# EAGLE design sensor_de aplausos (EAGLE 6.5.0)
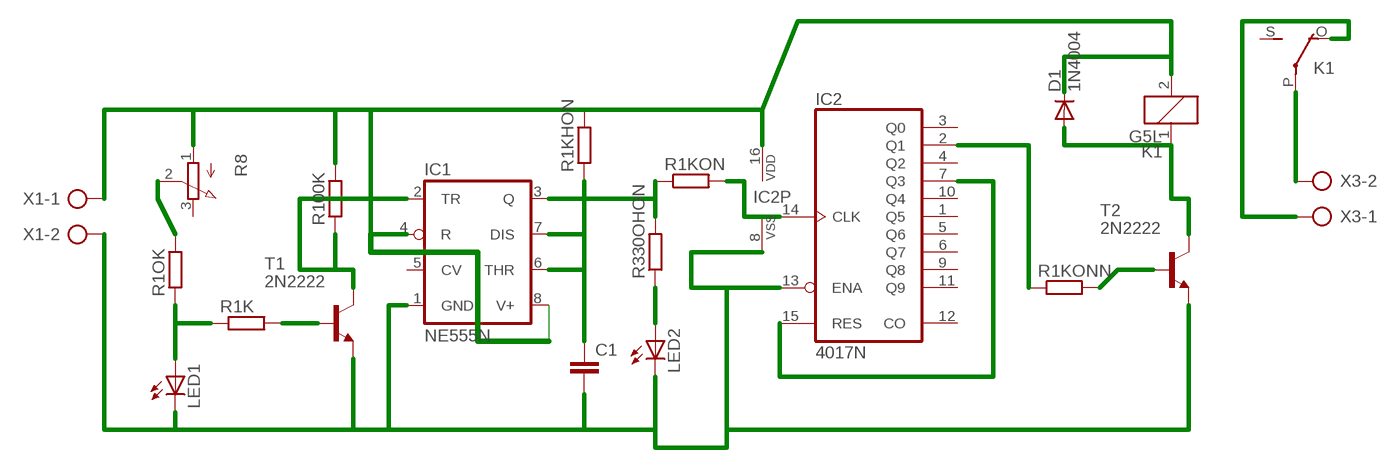
[diagram p0: schematic, sheet 1]

## Parts
C1  C5/5  [C5B5]
D1  1N4004  [DO41-10]
IC1  NE555N  [DIL08]
IC2  4017N  [DIL16]
K1  G5L  [G5LE]
LED1  LED5MM  [LED5MM]
LED2  LED5MM  [LED5MM]
R1K  R-EU_0207/12  [0207/12]
R1KHON  R-EU_0207/12  [0207/12]
R1KON  R-EU_0207/12  [0207/12]
R1KONN  R-EU_0207/12  [0207/12]
R1OK  R-EU_0207/12  [0207/12]
R8  3RP/1610N  [3RP/1610N]
R100K  R-EU_0207/12  [0207/12]
R330OHON  R-EU_0207/12  [0207/12]
T1  2N2222  [TO18]
T2  2N2222  [TO18]
X1  AK300/2  [AK300/2]
X3  AK300/2  [AK300/2]

## Nets
N$1: K1.P(2:P) X3.2
N$2: R1OK.2 R8.2(S)
N$4: D1.C IC1.4(R) IC1.8(V+) IC2.16(VDD) K1.2 R1KHON.2 R8.1(A) R100K.2 X1.1
N$5: LED1.A R1K.1 R1OK.1
N$6: IC1.2(TR) R100K.1 T1.3(C)
N$7: R1K.2 T1.2(B)
N$8: K1.O(2:O) X3.1
N$10: C1.1 IC1.6(THR) IC1.7(DIS) R1KHON.1
N$11: IC2.2(Q1) R1KONN.1
N$12: D1.A K1.1 T2.3(C)
N$13: IC1.3(Q) R1KON.1 R330OHON.2
N$14: LED2.A R330OHON.1
N$15: R1KONN.2 T2.2(B)
N$16: IC2.14(CLK) R1KON.2
N$17: IC2.7(Q3) IC2.15(RES)
N$18: C1.2 IC1.1(GND) IC2.8(VSS) IC2.13(ENA) LED1.K(C) LED2.K(C) T1.1(E) T2.1(E) X1.2
Unconnected: IC1.5(CV) IC2.1(Q5) IC2.3(Q0) IC2.4(Q2) IC2.5(Q6) IC2.6(Q7) IC2.9(Q8) IC2.10(Q4) IC2.11(Q9) IC2.12(CO) K1.S(2:S) R8.3(E)

## Library data of the parts
C1 = capacitor-wima:C: CAPACITOR naming: grid - package width
D1 = diode:1N4004: DIODE general purpose rectifier, 1 A
IC1 = linear:*555: TIMER
IC2 = 40xx:4017: COUNTER/DIVIDER
K1 = relay:G5L: RELAY 1 x switch, 10 A/120 V AC, 8 A/30 V ADC, Omron; OC_FARNELL: unknown; OC_NEWARK: unknown
LED1 LED2 = led:LED: LED OSRAM: - CHIPLED LG R971, LG N971, LY N971, LG Q971, LY Q971, LO R971, LY R971 LH N974, LH R974 LS Q976, LO Q976, LY Q976 LO Q996 - Hyper CHIPLED LW Q18S LB Q993, LB Q99A, LB R99A - SideLED LS A670, LO A670, LY A670, LG A670, LP A670 LB A673, LV A673, LT A673, LW A673 LH A674 LY A675 LS A676, LA A676, LO A676, LY A676, LW A676 LS A679, LY A679, LG A679 - Hyper Micro SIDELED® LS Y876, LA Y876, LO Y876, LY Y876 LT Y87S - SmartLED LW L88C, LW L88S LB L89C, LB L89S, LG L890 LS L89K, LO L89K, LY L89K LS L896, LA L896, LO L896, LY L896 - TOPLED LS T670, LO T670, LY T670, LG T670, LP T670 LSG T670, LSP T670, LSY T670, LOP T670, LYG T670 LG T671, LOG T671, LSG T671 LB T673, LV T673, LT T673, LW T673 LH T674 LS T676, LA T676, LO T676, LY T676, LB T676, LH T676, LSB T676, LW T676 LB T67C, LV T67C, LT T67C, LS T67K, LO T67K, LY T67K, LW E67C LS E67B, LA E67B, LO E67B, LY E67B, LB E67C, LV E67C, LT E67C LW T67C LS T679, LY T679, LG T679 LS T770, LO T770, LY T770, LG T770, LP T770 LB T773, LV T773, LT T773, LW T773 LH T774 LS E675, LA E675, LY E675, LS T675 LS T776, LA T776, LO T776, LY T776, LB T776 LHGB T686 LT T68C, LB T68C - Hyper Mini TOPLED® LB M676 - Mini TOPLED Santana® LG M470 LS M47K, LO M47K, LY M47K Source: http://www.osram.convergy.de LUXEON: - LUMILED® LXK2-PW12-R00, LXK2-PW12-S00, LXK2-PW14-U00, LXK2-PW14-V00 LXK2-PM12-R00, LXK2-PM12-S00, LXK2-PM14-U00 LXK2-PE12-Q00, LXK2-PE12-R00, LXK2-PE12-S00, LXK2-PE14-T00, LXK2-PE14-U00 LXK2-PB12-K00, LXK2-PB12-L00, LXK2-PB12-M00, LXK2-PB14-N00, LXK2-PB14-P00, LXK2-PB14-Q00 LXK2-PR12-L00, LXK2-PR12-M00, LXK2-PR14-Q00, LXK2-PR14-R00 LXK2-PD12-Q00, LXK2-PD12-R00, LXK2-PD12-S00 LXK2-PH12-R00, LXK2-PH12-S00 LXK2-PL12-P00, LXK2-PL12-Q00, LXK2-PL12-R00 Source: www.luxeon.com KINGBRIGHT: KA-3528ASYC Source: www.kingbright.com
R1K R1KHON R1KON R1KONN R1OK R100K R330OHON = resistor:R-EU_: RESISTOR, European symbol
R8 = pot:3RP/1610N: 16mm Potentiometer one level Source: http://www.alphapotentiometers.net/html/16mm_pot_2.html
T1 T2 = transistor:2N2222: NPN TRANSISTOR
X1 X3 = con-ptr500:AK300/2: CONNECTOR; OC_FARNELL: unknown; OC_NEWARK: unknown

## Board
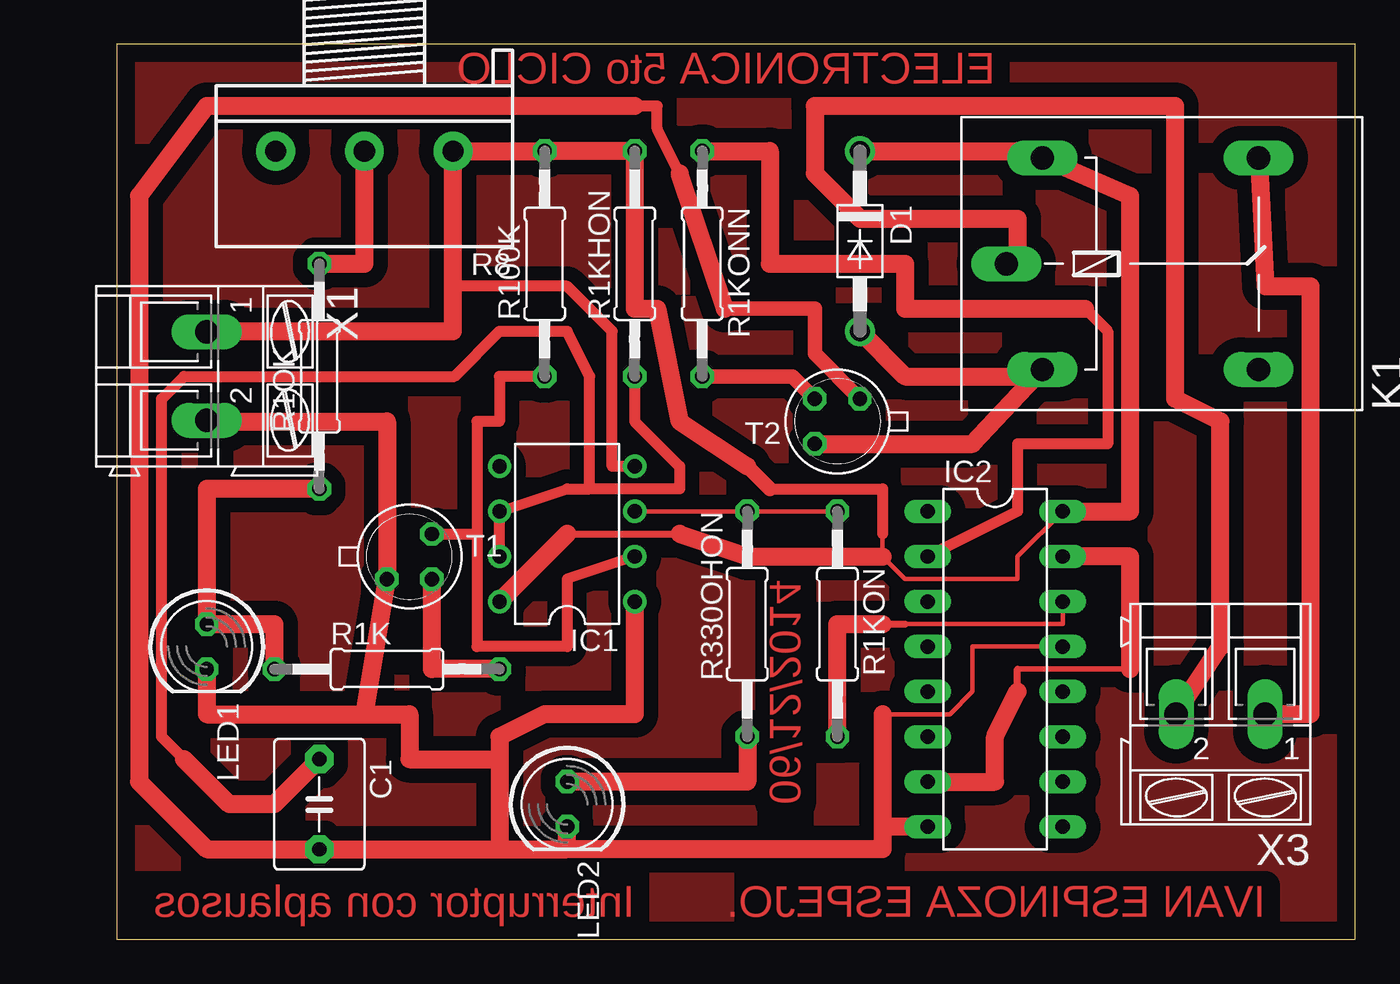
[diagram p1: board, top side]

Size 69.83 x 50.47 mm. Coordinates in mm from the lower left corner, seen from the top.
Outline: 0,0 69.83,0 69.83,50.47 0,50.47 0,0
Copper layers (1*16): Top 0.035mm / dielectric 1.5mm / Bottom 0.035mm
Design rules "default": minimum track width 10mil, minimum drill 24mil, track to track 8mil, track to pad 8mil, pad to pad 8mil, via to via 8mil, smd to smd 8mil, copper to edge 40mil, drill to drill 8mil, minimum pad ring 10mil, minimum via ring 8mil, stop-mask expansion 4mil, vias tented up to drill 0mil, thermal gap 10mil

### Footprints (pad centres in the part's own frame; a part is rotated, then mirrored left to right if it is on the bottom)
C5B5 = drill 0.813 pad 1.6 octagon: 1 -2.54,0; 2 2.54,0
DO41-10 = drill 1.118: A 5.08,0; C -5.08,0
DIL08 = drill 0.813 pad 1.27: 1 -3.81,-3.81; 2 -1.27,-3.81; 3 1.27,-3.81; 4 3.81,-3.81; 5 3.81,3.81; 6 1.27,3.81; 7 -1.27,3.81; 8 -3.81,3.81
DIL16 = drill 0.813 long: 1 -8.89,-3.81; 2 -6.35,-3.81; 3 -3.81,-3.81; 4 -1.27,-3.81; 5 1.27,-3.81; 6 3.81,-3.81; 7 6.35,-3.81; 8 8.89,-3.81; 9 8.89,3.81; 10 6.35,3.81; 11 3.81,3.81; 12 1.27,3.81; 13 -1.27,3.81; 14 -3.81,3.81; 15 -6.35,3.81; 16 -8.89,3.81
G5LE = drill 1.321 long: 1 -7.493,-5.969; 2 -7.493,5.969; O 4.699,5.969; P -9.525,0; S 4.699,-5.969
LED5MM = drill 0.813 octagon: A -1.27,0; K 1.27,0
0207/12 = drill 0.813 octagon: 1 -6.35,0; 2 6.35,0
3RP/1610N = drill 1.2 pad 2.184: 1 -5,0; 2 0,0; 3 5,0
TO18 = drill 0.813 octagon: 1 -1.27,-1.27; 2 1.27,-1.27; 3 1.27,1.27
AK300/2 = drill 1.321 long: 1 -2.515,0; 2 2.489,0

### Placement (x,y rotation side)
C1  11.43,7.62 270 top
D1  41.91,39.37 270 top
IC1  25.4,22.86 90 top
IC2  49.53,15.24 270 top
K1  59.69,38.1 0 top
LED1  5.08,16.51 270 top
LED2  25.4,7.62 270 top
R1K  15.24,15.24 0 top
R1KHON  29.21,38.1 90 top
R1KON  40.64,17.78 270 top
R1KONN  33.02,38.1 270 top
R1OK  11.43,31.75 90 top
R8  13.97,44.45 180 top
R100K  24.13,38.1 90 top
R330OHON  35.56,17.78 90 top
T1  16.51,21.59 0 top
T2  40.64,29.21 180 top
X1  5.08,31.75 270 top
X3  62.23,12.7 180 top

### Tracks (layer width: path | path; a pad name or v marks a point on that pad's centre or on a via)
N$1
  Top 0.254: 59.69,12.7 X3.2
  Top 1.016: 59.69,12.7 62.23,16.51 62.23,29.21 59.69,30.48 59.69,46.99 39.37,46.99 39.37,43.18 41.91,40.64 50.8,40.64 50.8,38.1 K1.P
N$2
  Top 1.016: R1OK.2 13.97,38.1 R8.2
N$3
  pour Top (isolate 0.813): 0,50.8 0,0 69.85,0 69.85,50.8
N$4
  Top 0.254: 5.08,34.29 X1.1 | 52.07,44.45 K1.2 | 43.18,22.86 43.18,21.59 44.45,20.32 50.8,20.32 50.8,21.59 IC2.16
  Top 0.406: 25.4,22.86 31.75,22.86
  Top 0.61: IC1.4 27.94,26.67 27.94,34.29 25.4,36.83 18.97,36.83 | 36.83,25.4 43.18,25.4 43.18,22.86
  Top 0.813: 35.56,26.67 36.83,25.4
  Top 1.016: 5.08,34.29 18.97,34.29 18.97,36.83 R8.1 R100K.2 R1KHON.2 29.21,35.56 30.48,35.56 31.75,29.21 35.56,26.67 | IC1.8 25.4,22.86 | 31.75,22.86 35.56,21.59 43.18,21.59 | IC2.16 57.15,24.13 57.15,41.91 K1.2 | 53.34,44.45 K1.2 | D1.C 50.8,44.45 K1.2
N$5
  Top 1.016: R1OK.1 5.08,25.4 LED1.A 8.89,17.78 R1K.1
N$6
  Top 0.61: IC1.2 25.4,20.32 25.4,16.51 20.32,16.51 20.32,22.86 | R100K.1 21.59,31.75 21.59,29.21 20.32,29.21 20.32,22.86 | T1.3 20.32,22.86
N$7
  Top 1.016: R1K.2 17.78,15.24 T1.2
N$8
  Top 1.016: K1.O 64.77,36.83 67.31,36.83 67.31,12.7 64.77,12.7 X3.1
N$10
  Top 0.61: 3.81,10.16 2.54,11.43 2.54,30.48 3.81,31.75 19.05,31.75 21.59,34.29 25.4,34.29 26.67,31.75 26.67,25.4 | IC1.7 IC1.6 25.4,25.4 26.67,25.4 | R1KHON.1 29.21,29.21 31.75,26.67 31.75,25.4 26.67,25.4
  Top 1.016: C1.1 8.89,7.62 6.35,7.62 3.81,10.16
N$11
  Top 0.61: 54.61,35.56 55.88,34.29 55.88,27.94 50.8,27.94 50.8,24.13 IC2.2
  Top 1.016: R1KONN.1 36.83,44.45 36.83,38.1 44.45,38.1 44.45,35.56 54.61,35.56
N$12
  Top 0.254: 52.07,31.75 K1.1
  Top 1.016: D1.A 44.45,31.75 53.34,31.75 K1.1 48.26,27.94 T2.3
N$13
  Top 0.254: IC1.3 R330OHON.2 R1KON.1
N$14
  Top 1.016: R330OHON.1 35.56,8.89 LED2.A
N$15
  Top 0.813: R1KONN.2 38.1,31.75 T2.2
N$16
  Top 0.254: 44.45,17.78 53.34,17.78 IC2.14
  Top 0.406: 43.18,17.78 44.45,17.78
  Top 1.016: R1KON.2 40.64,17.78 43.18,17.78
N$17
  Top 0.305: 50.8,15.24 57.15,15.24
  Top 0.406: 50.8,13.97 50.8,15.24
  Top 1.016: IC2.7 49.53,8.89 49.53,11.43 50.8,13.97 | 57.15,15.24 57.15,21.59 IC2.15
N$18
  Top 0.254: 5.08,29.21 X1.2 | IC2.13 48.26,16.51 48.26,13.97 46.99,12.7 43.18,12.7
  Top 0.61: 31.75,43.18 30.48,45.72 30.48,46.99 29.21,46.99
  Top 0.813: T2.1 39.37,33.02 39.37,35.56 34.29,35.56
  Top 1.016: 29.21,46.99 5.08,46.99 1.27,41.91 1.27,8.89 5.08,5.08 C1.2 21.59,5.08 | 5.08,29.21 15.24,29.21 T1.1 13.97,12.7 | LED1.K 5.08,12.7 13.97,12.7 | 21.59,5.08 25.4,5.08 | 25.4,5.08 LED2.K | 43.18,6.35 43.18,5.08 25.4,5.08 | 34.29,35.56 31.75,43.18 | IC2.8 43.18,6.35 | 43.18,12.7 43.18,6.35 | IC1.1 29.21,12.7 24.13,12.7 21.59,11.43 21.59,10.16 | 21.59,10.16 21.59,5.08 | 13.97,12.7 16.51,12.7 16.51,10.16 21.59,10.16

### Text on the board
Top: ELECTRONICA 5to CICLO | 06/12/2014 | Interruptor con aplausos | IVAN ESPINOZA ESPEJO.